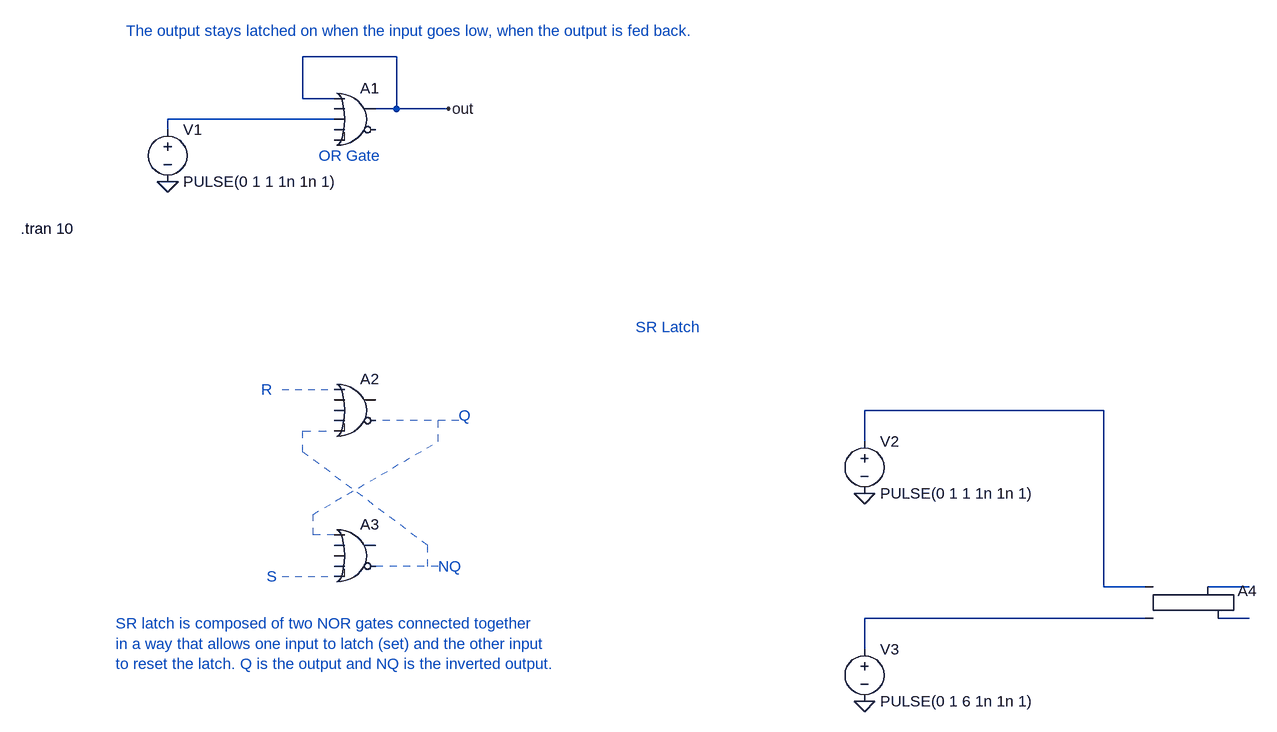
[diagram p0: schematic SR Latch.asc]
SR Latch.asc, the LTspice schematic file:
Version 4
SHEET 1 1892 1652
WIRE 464 16 320 16
WIRE 320 80 320 16
WIRE 368 80 320 80
WIRE 464 96 464 16
WIRE 464 96 432 96
WIRE 544 96 464 96
WIRE 368 112 112 112
WIRE 112 128 112 112
WIRE 1552 560 1184 560
WIRE 1184 608 1184 560
WIRE 1552 832 1552 560
WIRE 1616 832 1552 832
WIRE 1776 832 1712 832
WIRE 1616 880 1184 880
WIRE 1776 880 1728 880
WIRE 1184 928 1184 880
FLAG 112 208 0
FLAG 544 96 out
FLAG 1184 688 0
FLAG 1184 1008 0
SYMBOL voltage 112 112 R0
WINDOW 123 0 0 Left 0
WINDOW 39 0 0 Left 0
SYMATTR InstName V1
SYMATTR Value PULSE(0 1 1 1n 1n 1)
SYMBOL Digital\\or 400 48 R0
SYMATTR InstName A1
SYMATTR Value2 5
SYMBOL Digital\\or 400 496 R0
SYMATTR InstName A2
SYMBOL Digital\\or 400 720 R0
SYMATTR InstName A3
SYMBOL Digital\\srflop 1664 784 R0
SYMATTR InstName A4
SYMBOL voltage 1184 592 R0
WINDOW 123 0 0 Left 0
WINDOW 39 0 0 Left 0
SYMATTR InstName V2
SYMATTR Value PULSE(0 1 1 1n 1n 1)
SYMBOL voltage 1184 912 R0
WINDOW 123 0 0 Left 0
WINDOW 39 0 0 Left 0
SYMATTR InstName V3
SYMATTR Value PULSE(0 1 6 1n 1n 1)
TEXT -114 280 Left 2 !.tran 10
TEXT 48 -24 Left 2 ;The output stays latched on when the input goes low, when the output is fed back.
TEXT 344 168 Left 2 ;OR Gate
TEXT 832 432 Left 2 ;SR Latch
TEXT 256 528 Left 2 ;R
TEXT 560 568 Left 2 ;Q
TEXT 528 800 Left 2 ;NQ
TEXT 264 816 Left 2 ;S
TEXT 32 888 Left 2 ;SR latch is composed of two NOR gates connected together\nin a way that allows one input to latch (set) and the other input\nto reset the latch. Q is the output and NQ is the inverted output.
LINE Normal 288 528 368 528 2
LINE Normal 560 576 432 576 2
LINE Normal 320 592 368 592 2
LINE Normal 320 624 320 592 2
LINE Normal 512 768 320 624 2
LINE Normal 512 800 512 768 2
LINE Normal 528 800 432 800 2
LINE Normal 528 608 528 576 2
LINE Normal 336 720 528 608 2
LINE Normal 336 752 336 720 2
LINE Normal 368 752 336 752 2
LINE Normal 288 816 368 816 2

The netlist it stands for:
* SR Latch.asc
V1 N001 0 PULSE(0 1 1 1n 1n 1)
A1 out 0 N001 0 0 0 out 0 OR 5
A2 0 0 0 0 0 0 0 0 OR
A3 0 0 0 0 0 0 0 0 OR
A4 N002 N004 0 0 0 N005 N003 0 SRFLOP
V2 N002 0 PULSE(0 1 1 1n 1n 1)
V3 N004 0 PULSE(0 1 6 1n 1n 1)
.tran 10
* The output stays latched on when the input goes low, when the output is fed back.
* OR Gate
* SR Latch
* R
* Q
* NQ
* S
* SR latch is composed of two NOR gates connected together
* in a way that allows one input to latch (set) and the other input
* to reset the latch. Q is the output and NQ is the inverted output.
.backanno
.end